# Altium schematic sheet Interlock Multiplexer.SchDoc
size A4; Author: Peake J; CompanyName: Scion Research; DrawnBy: Peake J; Engineer: Peake J; Organization: Scion; Address1: 49 Sala St; Address2: Whakarewarewa; Address3: Rotorua; Address4: New Zealand 3010
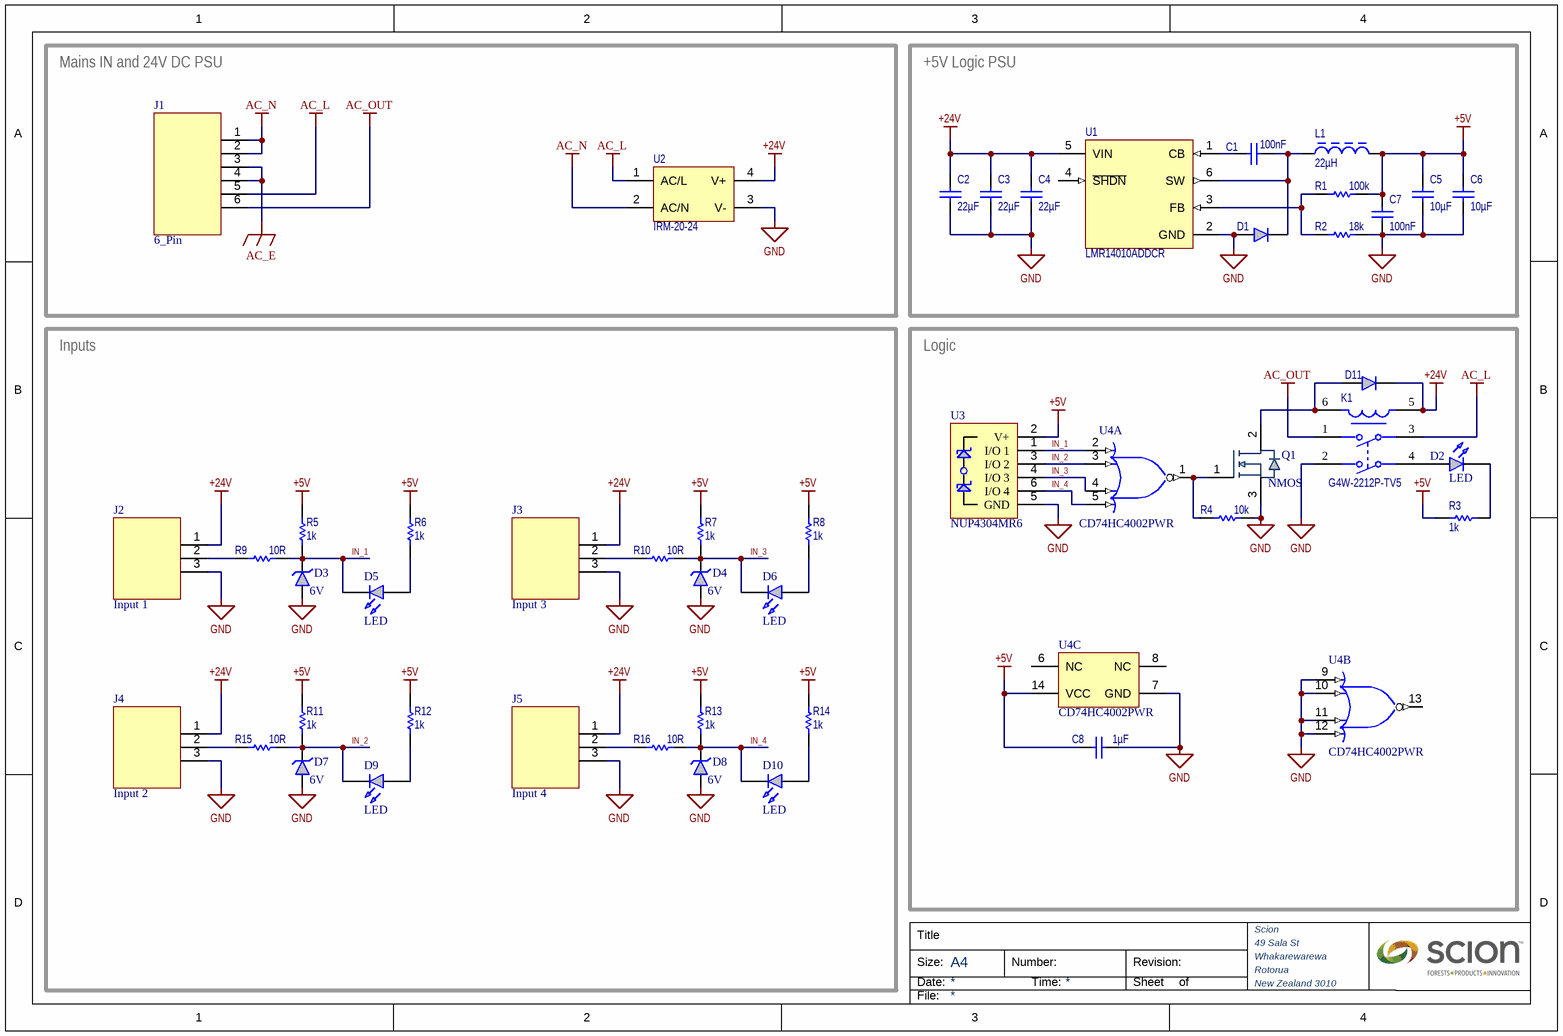
[diagram p0: Interlock Multiplexer.SchDoc]

## Parts
C1  value 100nF  [0603_CAP]  (hidden comment: Capacitor)
C2  value 22µF  [1206_CAP]  (hidden comment: Capacitor)
C3  value 22µF  [1206_CAP]  (hidden comment: Capacitor)
C4  value 22µF  [1206_CAP]  (hidden comment: Capacitor)
C5  value 10µF  [0603_CAP]  (hidden comment: Capacitor)
C6  value 10µF  [0603_CAP]  (hidden comment: Capacitor)
C7  value 100nF  [0603_CAP]  (hidden comment: Capacitor)
C8  value 1µF  [0603_CAP]  (hidden comment: Capacitor)
D1  Diode  [SOD-123]  (value not drawn)
D2  LED  [0805]
D3  Rated Voltage: 6V  [SMBJ]  (hidden comment: Transil)
D4  Rated Voltage: 6V  [SMBJ]  (hidden comment: Transil)
D5  LED  [0805]
D6  LED  [0805]
D7  Rated Voltage: 6V  [SMBJ]  (hidden comment: Transil)
D8  Rated Voltage: 6V  [SMBJ]  (hidden comment: Transil)
D9  LED  [0805]
D10  LED  [0805]
D11  Diode  [SOD-123]  (value not drawn)
J1  6_Pin  [TDPT 6p 5.08]
J2  Input 1  [3_Pin 3.81mm Molex 395111-003]
J3  Input 3  [3_Pin 3.81mm Molex 395111-003]
J4  Input 2  [3_Pin 3.81mm Molex 395111-003]
J5  Input 4  [3_Pin 3.81mm Molex 395111-003]
K1  G4W-2212P-TV5  [G4W-2212P-US-TV5 24VDC-Footprint-1]
L1  value 22µH  [BOUR-SRN8040_V]  (hidden comment: Inductor)
Q1  NMOS  [SOT-23]
R1  value 100k  [0603_RES]  (hidden comment: Resistor)
R2  value 18k  [0603_RES]  (hidden comment: Resistor)
R3  value 1k  [0603_RES]  (hidden comment: Resistor)
R4  value 10k  [0603_RES]  (hidden comment: Resistor)
R5  value 1k  [0603_RES]  (hidden comment: Resistor)
R6  value 1k  [0603_RES]  (hidden comment: Resistor)
R7  value 1k  [0603_RES]  (hidden comment: Resistor)
R8  value 1k  [0603_RES]  (hidden comment: Resistor)
R9  value 10R  [0603_RES]  (hidden comment: Resistor)
R10  value 10R  [0603_RES]  (hidden comment: Resistor)
R11  value 1k  [0603_RES]  (hidden comment: Resistor)
R12  value 1k  [0603_RES]  (hidden comment: Resistor)
R13  value 1k  [0603_RES]  (hidden comment: Resistor)
R14  value 1k  [0603_RES]  (hidden comment: Resistor)
R15  value 10R  [0603_RES]  (hidden comment: Resistor)
R16  value 10R  [0603_RES]  (hidden comment: Resistor)
U1  LMR14010ADDCR  [FP-DDC0006A-IPC_A]
U2  IRM-20-24  [IRM-20-24-Footprint-1]
U3  NUP4304MR6  [TSOP-6]
U4  CD74HC4002PWR  [PW0014A_N]  (parts A,B,C of 3)

## Blocks framed on the sheet
Mains IN and 24V DC PSU: J1 U2
+5V Logic PSU: C1-C7 D1 L1 R1 R2 U1
Inputs: D3-D10 J2-J5 R5-R16
Logic: C8 D2 D11 K1 Q1 R3 R4 U3 U4

## Nets
+5V: C5.1 C6.1 C7.1 C8.1 L1.2 R1.2 R3.2 R5.2 R6.2 R7.2 R8.2 R11.2 R12.2 R13.2 R14.2 U3.2(V+) U4.14(VCC)
+24V: C2.1 C3.1 C4.1 D11.1(K) J2.1 J3.1 J4.1 J5.1 K1.5 U1.5(VIN) U2.4(V+)
AC_E: J1.3 J1.4
AC_L: J1.5 K1.3 U2.1(AC/L)
AC_N: J1.1 J1.2 U2.2(AC/N)
AC_OUT: J1.6 K1.1
GND: C2.2 C3.2 C4.2 C5.2 C6.2 C7.2 C8.2 D1.2(A) D3.1(A) D4.1(A) D7.1(A) D8.1(A) J2.3 J3.3 J4.3 J5.3 K1.2 Q1.3(S) R2.2 R4.2 U1.2(GND) U2.3(V-) U3.5(GND) U4.7(GND) U4.9(2A) U4.10(2B) U4.11(2C) U4.12(2D)
IN_1: D3.2(K) D5.1(K) R5.1 R9.2 U3.1(I/O_1) U4.2(1A)
IN_2: D7.2(K) D9.1(K) R11.1 R15.2 U3.3(I/O_2) U4.3(1B)
IN_3: D4.2(K) D6.1(K) R7.1 R10.2 U3.4(I/O_3) U4.4(1C)
IN_4: D8.2(K) D10.1(K) R13.1 R16.2 U3.6(I/O_4) U4.5(1D)
NetC1_1: C1.1 D1.1(K) L1.1 U1.6(SW)
NetC1_2: C1.2 U1.1(CB)
NetD2_1: D2.1(K) R3.1
NetD2_2: D2.2(A) K1.4
NetD5_2: D5.2(A) R6.1
NetD6_2: D6.2(A) R8.1
NetD9_2: D9.2(A) R12.1
NetD10_2: D10.2(A) R14.1
NetD11_2: D11.2(A) K1.6 Q1.2(D)
NetJ2_2: J2.2 R9.1
NetJ3_2: J3.2 R10.1
NetJ4_2: J4.2 R15.1
NetJ5_2: J5.2 R16.1
NetQ1_1: Q1.1(G) R4.1 U4.1(1Y)
NetR1_1: R1.1 R2.1 U1.3(FB)

Not connected (* = marked no-connect by the designer): U1 4(~{SHDN}); U4 6(NC) 8(NC) 13(2Y)

## Notes on the sheet
- Title
- Size:
- Date:
- A4
- Number:
- Time:
- Revision:
- Sheet
- of
- File:

## Library data of the parts
C1-C8 = CMP-001-00172-2: SMD Capacitor; Pins: 2; Source: Discrete.SchLib; Design Item ID: Capacitor; Component Type: Standard
D1 D11 = CMP-004-00083-4: SMD Diode; Design Item ID: Diode; Pins: 2; Source: Discrete.SchLib; Component Type: Standard; Pin Count: 2
D2 D5 D6 D9 D10 = CMP-004-00084-3: SMD LED; Colour: RED; Pins: 2; Source: Discrete.SchLib; Design Item ID: LED; Component Type: Standard; Pin Count: 2
D3 D4 D7 D8 = CMP-079-000108-2: Transient Voltage Suppressor; Component Type: Standard; Pin Count: 2; Source: Discrete.SchLib; Breakdown Voltage: *; Design Item ID: Transil; MFN: *; Clamping Voltage: *
J1 = CMP-002-00180-3: 6 Pin Connector; Pins: 6; Component Type: Standard; Pin Count: 6; Design Item ID: 6_Pin; Source: Connectors.SchLib
J2-J5 = CMP-002-00174-3: 3 Pin Connector; Pin Count: 3; Source: Connectors.SchLib; Pins: 3; Component Type: Standard; Design Item ID: 3_Pin
K1 = CMP-079-000041-1: DPNO 10A 24VDC Relay; Pin Count: 6; Design Item ID: CMP-00056-1; Component Type: Standard; Source: All Components - 30.06.23 - 18.27.SchLib
L1 = CMP-006-00052-2: Power Inductor; DCR: 100mR; Current Rating: 2.2A; Pins: 2; Component Type: Standard; Design Item ID: Inductor; Source: Discrete.SchLib; Pin Count: 2; MFN: *
Q1 = CMP-079-000093-2: N Channel MOSFET; Design Item ID: NMOS; Source: N-MOS.SchLib; MFN: *; Pin Count: 3; Component Type: Standard
R1-R16 = CMP-009-00356-1: SMD Resistor; Pins: 2; Source: Discrete.SchLib; Component Type: Standard; Design Item ID: Resistor
U1 = CMP-079-000005-5: 7-40VDC-DC buck converter; Number of Outputs: 1; Max Output Voltage: 40V; Output Current: 1A; Min Input Voltage: 4V; Output Type: Adjustable; Synchronous Rectifier: No; Min Output Voltage: 765mV; Output Configuration: Positive; Switching Frequency: 850kHz; Max Operating Temperature: 125°C; Case/Package: SOT-23-6; Features: UVLO; Pin Count: 6; Packaging: Cut Tape; Mount: Surface Mount; Component Type: Standard; Min Operating Temperature: -40°C; Max Input Voltage: 40V; Source: All Components - 30.06.23 - 18.27.SchLib; Design Item ID: CMP-00007-1
U2 = CMP-015-000004-2: AC/DC 20W 24V Single Output Power Supply, Encapsulated Board Mount Module; Efficiency: 85%; Max Output Current: 900mA; Approvals: UL,CE,TUV,CB; Output Power: 21.6W; Min Input Voltage (AC): 90V; Number of Outputs: 1; Max Input Voltage (AC): 264V; Series: IRM-20; Height: 24mm; Mount: Through Hole,PCB; Width: 28mm; RoHS Compliant: Yes; Number of Pins: 4; Package Quantity: 240; Pin Count: 4; Max Output Power: 21.6W; Max Operating Temperature: 70°C; Min Operating Temperature: -30°C; Source: All Components - 30.06.23 - 18.27.SchLib; Design Item ID: CMP-00053-2; Voltage - Output 1: 24V; Output Current: 900mA; Weight: 2.081164oz; Length: 53mm; Component Type: Standard; Case/Package: Module; Current - Output 1: 900mA
U3 = CMP-079-000096-2: ESD Protection Doide Array; Design Item ID: NUP4304MR6; Pin Count: 6; Component Type: Standard; Source: ON Semi.SchLib
U4 = CMP-016-00000-1: NOR Gate, HC Series, 2-Func, 4-Input, CMOS, PDSO14; Nominal Supply Voltage: 4.5V; Max Supply Voltage: 6V; Min Supply Voltage: 2V; Min Operating Temperature: -55°C; Pins: 14; Logic Type: NOR GATE; Max Operating Temperature: 125°C; RoHS Compliant: Yes; Case/Package: TSSOP